# Altium schematic sheet Camera.SchDoc
size A4; SheetNumber: 6; SheetTotal: 8
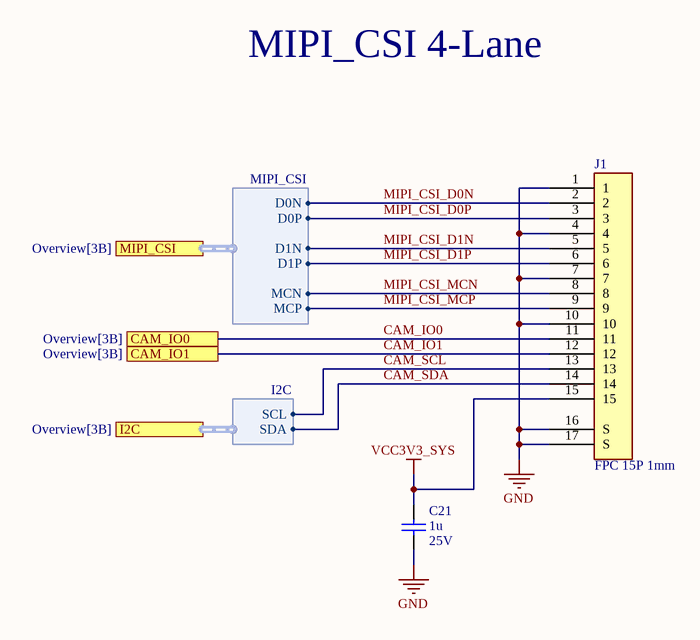
[diagram p0: Camera.SchDoc]

## Parts
C21  value 1u  Voltage: 25V  [GRM155R61E105KA12D]  (hidden comment: GRM155R61E105KA12D)
J1  FPC 15P 1mm

## Ports
CAM_IO0 (see Overview[3B]), CAM_IO1 (see Overview[3B]), I2C (harness I2C, see Overview[3B]), MIPI_CSI (harness MIPI_CSI, see Overview[3B])

## Harnesses
MIPI_CSI: D0N, D0P, MCN, MCP, D1P, D1N
I2C: SCL, SDA

## Nets
GND: C21.2 J1.1 J1.4 J1.7 J1.10 J1.16(S) J1.17(S)
VCC3V3_SYS: C21.1 J1.15
CAM_IO0: J1.11 ; port CAM_IO0
CAM_IO1: J1.12 ; port CAM_IO1
CAM_SCL: J1.13 ; port I2C.SCL
CAM_SDA: J1.14 ; port I2C.SDA
MIPI_CSI_D0N: J1.2 ; port MIPI_CSI.D0N
MIPI_CSI_D0P: J1.3 ; port MIPI_CSI.D0P
MIPI_CSI_D1N: J1.5 ; port MIPI_CSI.D1N
MIPI_CSI_D1P: J1.6 ; port MIPI_CSI.D1P
MIPI_CSI_MCN: J1.8 ; port MIPI_CSI.MCN
MIPI_CSI_MCP: J1.9 ; port MIPI_CSI.MCP

## Notes on the sheet
- MIPI_CSI 4-Lane

## Library data of the parts
C21 = GRM155R61E105KA12D: CAP 1U 25V X5R 0402; Size: 0402; Dielectric: X5R; Manufacturer Part Number 1: GRM155R61E105KA12D